# EAGLE schematic 24-SMD-adapter (EAGLE 6.3)
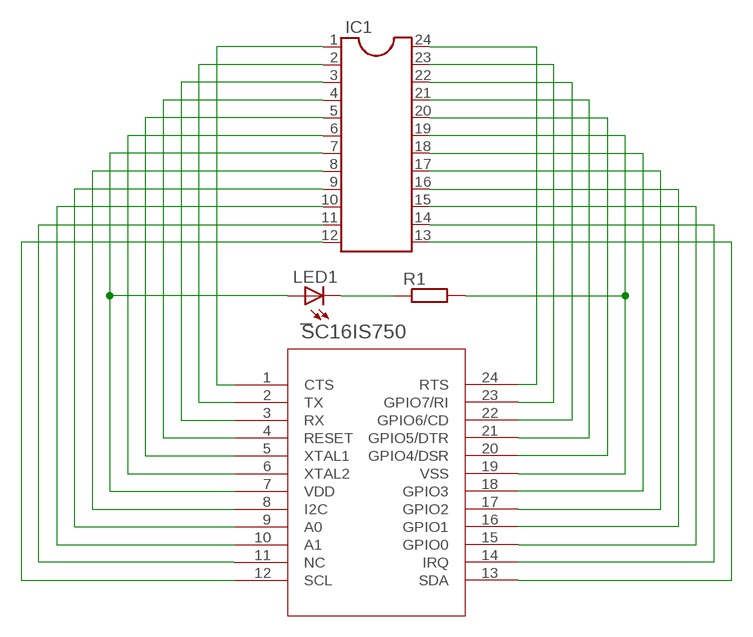
[diagram p0: schematic, sheet 1]

## Parts
_  SC16IS750  [SOT361_1_M]
IC1  DIL24-6  [DIL24-6]
LED1  LEDSML1206  [SML1206]
R1  R-EU_R0402  [R0402]

## Nets
N$1: _.1(CTS) IC1.1
N$2: _.2(TX) IC1.2
N$3: _.3(RX) IC1.3
N$4: _.4(RESET) IC1.4
N$5: _.5(XTAL1) IC1.5
N$6: _.6(XTAL2) IC1.6
N$7: _.7(VDD) IC1.7 LED1.A
N$8: _.8(I2C) IC1.8
N$9: _.9(A0) IC1.9
N$10: _.10(A1) IC1.10
N$11: _.11(NC) IC1.11
N$12: _.12(SCL) IC1.12
N$13: _.24(RTS) IC1.24
N$14: _.23(GPIO7/RI) IC1.23
N$15: _.22(GPIO6/CD) IC1.22
N$16: _.21(GPIO5/DTR) IC1.21
N$17: _.20(GPIO4/DSR) IC1.20
N$18: _.19(VSS) IC1.19 R1.2
N$19: _.18(GPIO3) IC1.18
N$20: _.17(GPIO2) IC1.17
N$21: _.16(GPIO1) IC1.16
N$22: _.15(GPIO0) IC1.15
N$23: _.14(IRQ) IC1.14
N$24: _.13(SDA) IC1.13
N$25: LED1.C R1.1

## Library data of the parts
_ = SC16IS750:SC16IS750
IC1 = ic-package:DIL24: Dual In Line
LED1 = led:LED: LED OSRAM: - CHIPLED LG R971, LG N971, LY N971, LG Q971, LY Q971, LO R971, LY R971 LH N974, LH R974 LS Q976, LO Q976, LY Q976 LO Q996 - Hyper CHIPLED LW Q18S LB Q993, LB Q99A, LB R99A - SideLED LS A670, LO A670, LY A670, LG A670, LP A670 LB A673, LV A673, LT A673, LW A673 LH A674 LY A675 LS A676, LA A676, LO A676, LY A676, LW A676 LS A679, LY A679, LG A679 - Hyper Micro SIDELED® LS Y876, LA Y876, LO Y876, LY Y876 LT Y87S - SmartLED LW L88C, LW L88S LB L89C, LB L89S, LG L890 LS L89K, LO L89K, LY L89K LS L896, LA L896, LO L896, LY L896 - TOPLED LS T670, LO T670, LY T670, LG T670, LP T670 LSG T670, LSP T670, LSY T670, LOP T670, LYG T670 LG T671, LOG T671, LSG T671 LB T673, LV T673, LT T673, LW T673 LH T674 LS T676, LA T676, LO T676, LY T676, LB T676, LH T676, LSB T676, LW T676 LB T67C, LV T67C, LT T67C, LS T67K, LO T67K, LY T67K, LW E67C LS E67B, LA E67B, LO E67B, LY E67B, LB E67C, LV E67C, LT E67C LW T67C LS T679, LY T679, LG T679 LS T770, LO T770, LY T770, LG T770, LP T770 LB T773, LV T773, LT T773, LW T773 LH T774 LS E675, LA E675, LY E675, LS T675 LS T776, LA T776, LO T776, LY T776, LB T776 LHGB T686 LT T68C, LB T68C - Hyper Mini TOPLED® LB M676 - Mini TOPLED Santana® LG M470 LS M47K, LO M47K, LY M47K Source: http://www.osram.convergy.de LUXEON: - LUMILED® LXK2-PW12-R00, LXK2-PW12-S00, LXK2-PW14-U00, LXK2-PW14-V00 LXK2-PM12-R00, LXK2-PM12-S00, LXK2-PM14-U00 LXK2-PE12-Q00, LXK2-PE12-R00, LXK2-PE12-S00, LXK2-PE14-T00, LXK2-PE14-U00 LXK2-PB12-K00, LXK2-PB12-L00, LXK2-PB12-M00, LXK2-PB14-N00, LXK2-PB14-P00, LXK2-PB14-Q00 LXK2-PR12-L00, LXK2-PR12-M00, LXK2-PR14-Q00, LXK2-PR14-R00 LXK2-PD12-Q00, LXK2-PD12-R00, LXK2-PD12-S00 LXK2-PH12-R00, LXK2-PH12-S00 LXK2-PL12-P00, LXK2-PL12-Q00, LXK2-PL12-R00 Source: www.luxeon.com KINGBRIGHT: KA-3528ASYC Source: www.kingbright.com
R1 = resistor:R-EU_: RESISTOR, European symbol